# EAGLE design brobotESP12_2 (EAGLE 7.1.0)

## Sheet 1 of 2
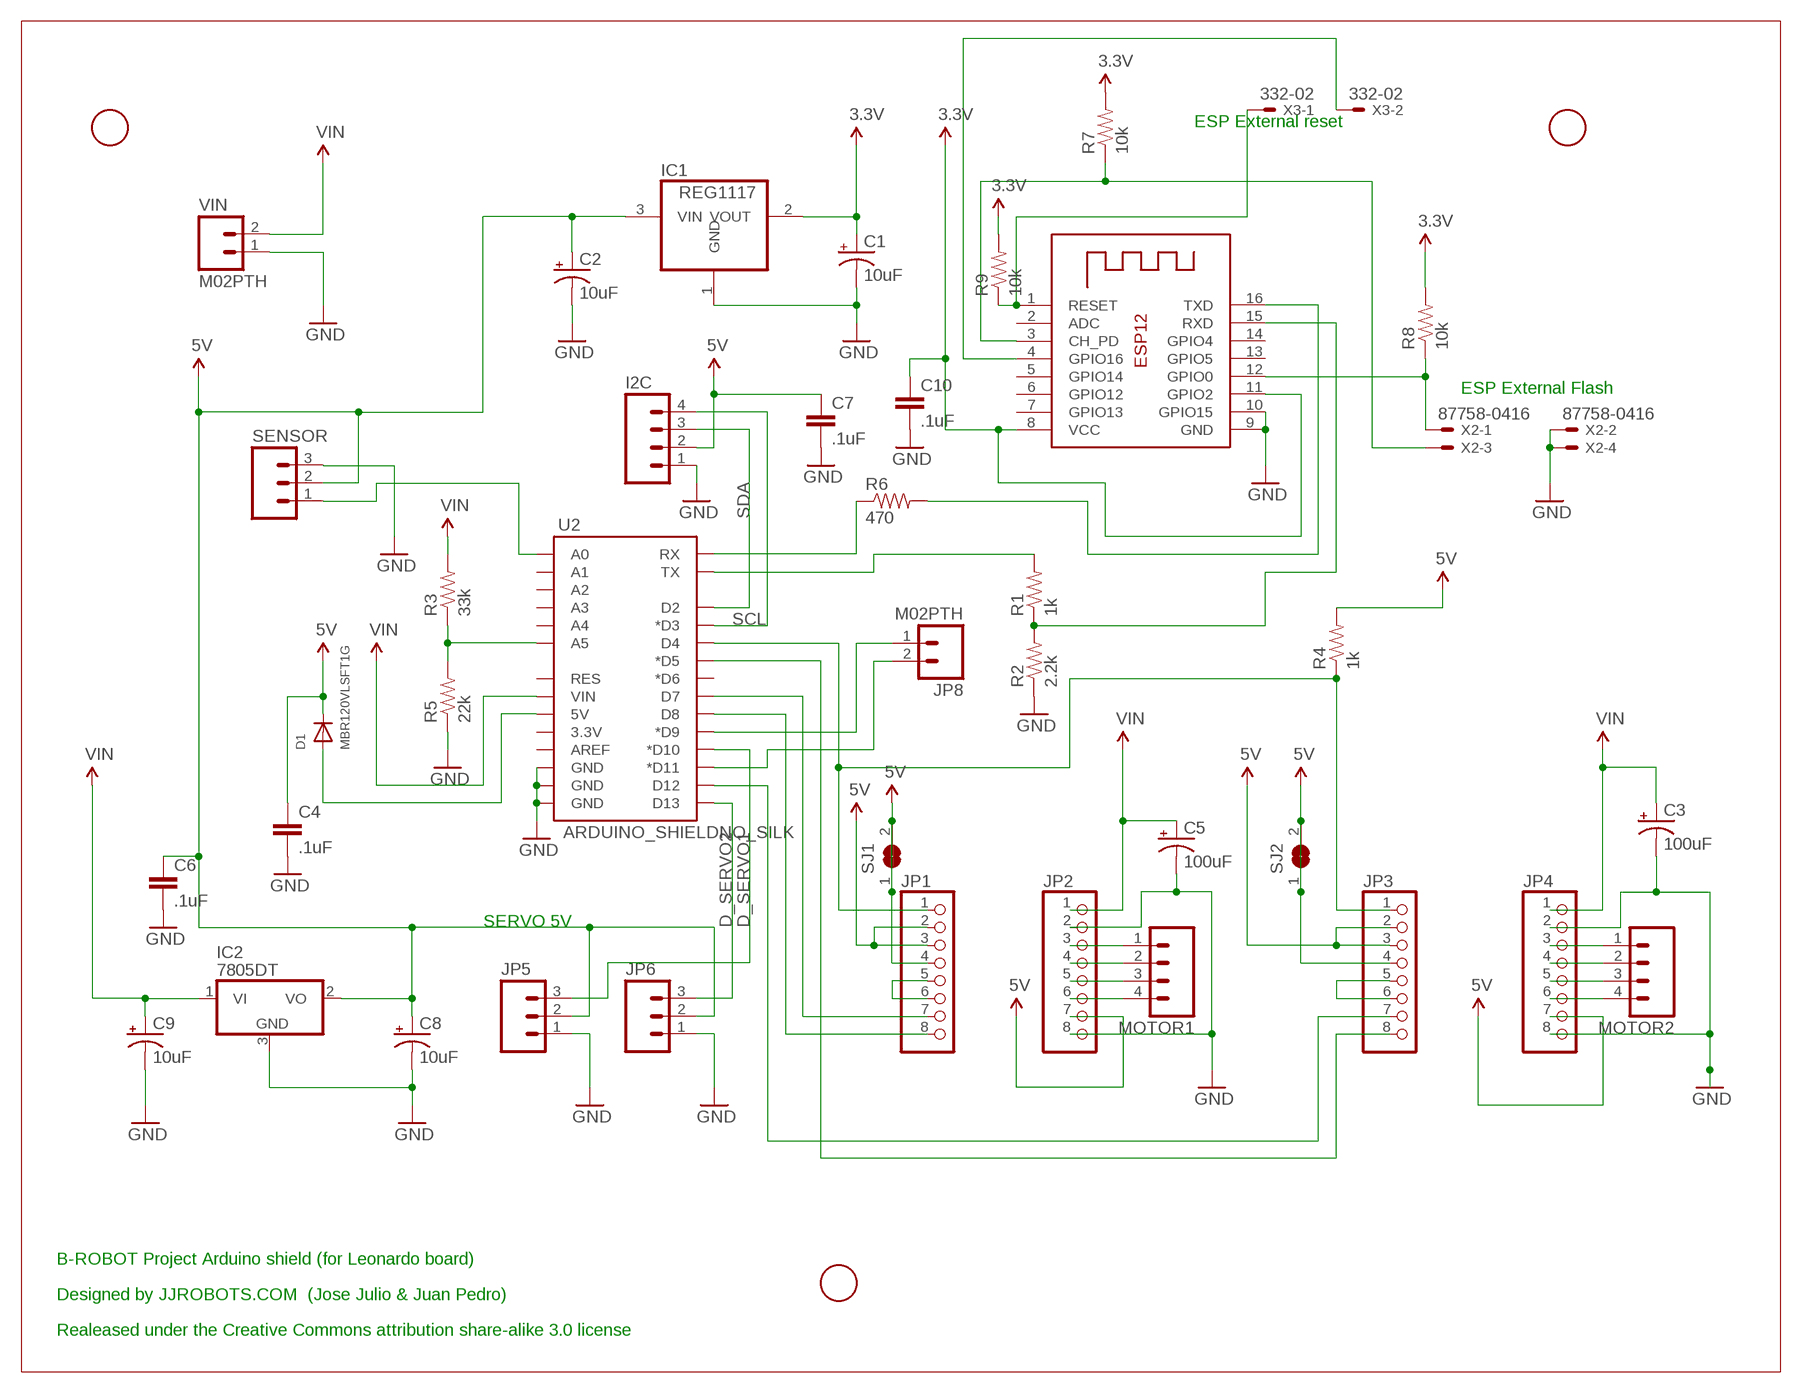
[diagram p0: schematic, sheet 1]

### Parts
C1  10uF  CAP_POL1206  [EIA3216]
C2  10uF  CAP_POL1206  [EIA3216]
C3  100uF  CAP_POLD  [PANASONIC_D]
C4  .1uF  CAP0402-CAP  [0402-CAP]
C5  100uF  CAP_POLD  [PANASONIC_D]
C6  .1uF  CAP0402-CAP  [0402-CAP]
C7  .1uF  CAP0402-CAP  [0402-CAP]
C8  10uF  CAP_POL1206  [EIA3216]
C9  10uF  CAP_POL1206  [EIA3216]
C10  .1uF  CAP0402-CAP  [0402-CAP]
D1  MBR120VLSFT1G  DIODESOD-123  [SOD-123]
I2C  M04PTH  [1X04]
IC1  REG1117  [SOT223]
IC2  7805DT  [TO252]
JP1  PINHD-1X8  [1X08]
JP2  PINHD-1X8  [1X08]
JP3  PINHD-1X8  [1X08]
JP4  PINHD-1X8  [1X08]
JP5  M03PTH  [1X03]
JP6  M03PTH  [1X03]
JP8  M02PTH  [1X02]
MOTOR1  M04PTH  [1X04]
MOTOR2  M04PTH  [1X04]
R1  1k  RESISTOR0805-RES  [0805]
R2  2.2k  RESISTOR0805-RES  [0805]
R3  33k  RESISTOR0805-RES  [0805]
R4  1k  RESISTOR0805-RES  [0805]
R5  22k  RESISTOR0805-RES  [0805]
R6  470  RESISTOR0805-RES  [0805]
R7  10k  RESISTOR0805-RES  [0805]
R8  10k  RESISTOR0805-RES  [0805]
R9  10k  RESISTOR0805-RES  [0805]
SENSOR  M03PTH  [1X03]
SJ1  SJW  [SJW]
SJ2  SJW  [SJW]
U2  ARDUINO_SHIELDNO_SILK  [DUEMILANOVE_VIAS]
U$1  FIDUCIAL  [FIDUCIAL_1MM]
U$2  FIDUCIAL  [FIDUCIAL_1MM]
U$3  FIDUCIAL  [FIDUCIAL_1MM]
VIN  M02PTH  [1X02]
X1  ESP-12  [ESP-12]
X2  87758-0416  [87758-0416]
X3  332-02  [332-02]

### Nets
3.3V [3V3]: C1.A(+) C10.1 IC1.2(VOUT) R7.2 R8.2 R9.2 X1.8(VCC) X1.11(GPIO2)
5V [5V]: C2.A(+) C4.1 C6.1 C7.1 C8.A(+) D1.C I2C.2 IC1.3(VIN) IC2.2(VO) JP1.2 JP1.3 JP1.4 JP2.7 JP3.2 JP3.3 JP3.4 JP4.7 JP5.2 JP6.2 R4.2 SENSOR.2 SJ1.1 SJ1.2 SJ2.1 SJ2.2 ; also sheet 2
A_SENSOR: SENSOR.1 U2.A0 ; also sheet 2
A_VOLTAGE [3V3]: R3.1 R5.2 U2.A5 ; also sheet 2
D4: JP1.1 JP3.1 R4.1 U2.D4 ; also sheet 2
D5: JP3.8 U2.D5(*D5) ; also sheet 2
D7: JP1.7 U2.D7 ; also sheet 2
D8: JP1.8 U2.D8 ; also sheet 2
D11: JP8.2 U2.D11(*D11) ; also sheet 2
D12: JP3.7 U2.D12 ; also sheet 2
D_SERVO1: JP5.3 U2.D10(*D10) ; also sheet 2
D_SERVO2: JP6.3 U2.D13 ; also sheet 2
GND [3V3]: C1.C(-) C2.C(-) C3.- C4.2 C5.- C6.2 C7.2 C8.C(-) C9.C(-) C10.2 I2C.1 IC1.1(GND) IC2.3(GND) JP2.2 JP2.8 JP4.2 JP4.8 JP5.1 JP6.1 R2.1 R5.1 SENSOR.3 U2.GND@0(GND) U2.GND@1(GND) U2.GND@2(GND) VIN.1 X1.9(GND) X1.10(GPIO15) X2.2 X2.4 ; also sheet 2
N$1 [VCC]: JP2.3 MOTOR1.1
N$2 [VCC]: JP2.4 MOTOR1.2
N$3: R6.2 X1.16(TXD)
N$4: R1.1 R2.2 X1.15(RXD)
N$6 [VCC]: JP2.5 MOTOR1.3
N$7 [VCC]: JP2.6 MOTOR1.4
N$8 [VCC]: JP4.3 MOTOR2.1
N$9 [VCC]: JP4.4 MOTOR2.2
N$10 [VCC]: JP4.5 MOTOR2.3
N$11: JP1.5 JP1.6
N$12: JP3.5 JP3.6
N$16 [VCC]: JP4.6 MOTOR2.4
N$18: R7.1 X1.3(CH_PD) X2.3
N$20 [3V3]: R8.1 X1.12(GPIO0) X2.1
N$26: D1.A U2.5V
N$27: JP8.1 U2.D9(*D9)
N$29: R9.1 X1.1(RESET) X3.1
N$30: X1.4(GPIO16) X3.2
RX_5V: R6.1 U2.RX ; also sheet 2
SCL [I2C]: I2C.4 U2.D3(*D3) ; also sheet 2
SDA [I2C]: I2C.3 U2.D2 ; also sheet 2
TX_5V: R1.2 U2.TX ; also sheet 2
VIN [VCC]: C3.+ C5.+ C9.A(+) IC2.1(VI) JP2.1 JP4.1 R3.2 U2.VIN VIN.2 ; also sheet 2
Unconnected: U2.3.3V U2.A1 U2.A2 U2.A3 U2.A4 U2.AREF U2.D6(*D6) U2.RES X1.2(ADC) X1.5(GPIO14) X1.6(GPIO12) X1.7(GPIO13) X1.13(GPIO5) X1.14(GPIO4)

### Notes on the sheet
- ESP External reset
- ESP External Flash
- SERVO 5V
- B-ROBOT Project Arduino shield (for Leonardo board)
- Designed by JJROBOTS.COM  (Jose Julio & Juan Pedro)
- Realeased under the Creative Commons attribution share-alike 3.0 license

## Sheet 2 of 2
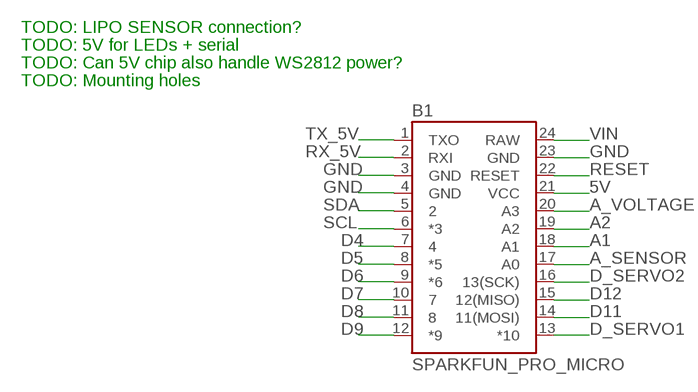
[diagram p1: schematic, sheet 2]

### Parts
B1  SPARKFUN_PRO_MICRO  [SPARKFUN_PRO_MICRO]

### Nets
5V [5V]: B1.21(VCC) ; also sheet 1
A1: B1.18(A1)
A2: B1.19(A2)
A_SENSOR: B1.17(A0) ; also sheet 1
A_VOLTAGE [3V3]: B1.20(A3) ; also sheet 1
D4: B1.7 ; also sheet 1
D5: B1.8(*5) ; also sheet 1
D6: B1.9(*6)
D7: B1.10 ; also sheet 1
D8: B1.11 ; also sheet 1
D9: B1.12(*9)
D11: B1.14(11(MOSI)) ; also sheet 1
D12: B1.15(12(MISO)) ; also sheet 1
D_SERVO1: B1.13(*10) ; also sheet 1
D_SERVO2: B1.16(13(SCK)) ; also sheet 1
GND [3V3]: B1.3(GND) B1.4(GND) B1.23(GND) ; also sheet 1
RESET: B1.22(RESET)
RX_5V: B1.2(RXI) ; also sheet 1
SCL [I2C]: B1.6(*3) ; also sheet 1
SDA [I2C]: B1.5 ; also sheet 1
TX_5V: B1.1(TXO) ; also sheet 1
VIN [VCC]: B1.24(RAW) ; also sheet 1

### Notes on the sheet
- TODO: LIPO SENSOR connection?
- TODO: 5V for LEDs + serial
- TODO: Can 5V chip also handle WS2812 power?
- TODO: Mounting holes

## Library data of the parts
B1 = SparkFun-Boards:SPARKFUN_PRO_MICRO: SparkFun Pro Micro Atmega32U4 compatible footprint. SparkFun Products: 3.3V/8MHz <https://www.sparkfun.com/products/12587> 5V/16MHz <https://www.sparkfun.com/products/12640>
C1-C3 C5 C8 C9 = SparkFun-Passives:CAP_POL: Capacitor Polarized These are standard SMD and PTH capacitors. Normally 10uF, 47uF, and 100uF in electrolytic and tantalum varieties. Always verify the external diameter of the through hole cap, it varies with capacity, voltage, and manufacturer. The EIA devices should be standard.
C4 C6 C7 C10 = SparkFun-Passives:CAP: Capacitor Standard 0603 ceramic capacitor, and 0.1" leaded capacitor.
D1 = adafruit:DIODE: Diode SMADIODE - SMA Surface Mount Package 20V 1A Schottky Diode Digikey: 641-1014-6-ND DO-1N4148 - Through Hole Small Current Diode SOD-123 20V 1 A (.5mV Vf) Schottky Diode - Digikey: MBRX120TPMSCT-ND SOD-323 10V 570mA (.38mV Vf, 3ns) Schottky Diode - Digikey: ZLLS410CT-ND SOD-523 30V 30mA Schottky Diode (RB751S-40TE61) - Digikey: RB751S-40TE61CT-ND SOT23-R/W - SOT23 Package (R = Solder Paste/Reflow Ovens, W = Hand-Soldering) BAT54Film 40V 300mA - Digikey: 497-7162-1-ND
I2C MOTOR1 MOTOR2 = SparkFun-Connectors:M04: Header 4 Standard 4-pin 0.1" header. Use with straight break away headers (SKU : PRT-00116), right angle break away headers (PRT-00553), swiss pins (PRT-00743), machine pins (PRT-00117), and female headers (PRT-00115). Molex polarized connector foot print use with SKU : PRT-08231 with associated crimp pins and housings. 1MM SMD Version SKU: PRT-10208
IC1 = burr-brown:REG1117: 800mA and 1A Low Dropout (LDO) Positive Regulator 1.8V, 2.5V, 2.85V, 3.3V, 5V, and Adj; MPN: REG1117; OC_FARNELL: 1097566; OC_NEWARK: 14P6981
IC2 = linear:78*: Positive VOLTAGE REGULATOR Source: http://cache.national.com/ds/LM/LM78L05.pdf http://www.fairchildsemi.com/ds/LM/LM7805.pdf
JP1-JP4 = pinhead:PINHD-1X8: PIN HEADER
JP5 JP6 SENSOR = SparkFun-Connectors:M03: Header 3 Standard 3-pin 0.1" header. Use with straight break away headers (SKU : PRT-00116), right angle break away headers (PRT-00553), swiss pins (PRT-00743), machine pins (PRT-00117), and female headers (PRT-00115). Molex polarized connector foot print use with SKU : PRT-08232 with associated crimp pins and housings.
JP8 VIN = SparkFun-Connectors:M02: Standard 2-pin 0.1" header. Use with - straight break away headers ( PRT-00116) - right angle break away headers (PRT-00553) - swiss pins (PRT-00743) - machine pins (PRT-00117) - female headers (PRT-00115) Molex polarized connector foot print use with: PRT-08233 with associated crimp pins and housings. 2.54_SCREWTERM for use with PRT-10571. 3.5mm Screw Terminal footprints for PRT-08084 5mm Screw Terminal footprints for use with PRT-08433
R1-R9 = SparkFun-Resistors:RESISTOR: Resistor Basic schematic elements and footprints for 0603, 1206, and PTH resistors.
SJ1 SJ2 = jumper:SJ: SMD solder JUMPER
U2 = SparkFun-Boards:ARDUINO_SHIELD: Arduino shield footprint
U$1-U$3 = adafruit:FIDUCIAL: For use by pick and place machines to calibrate the vision/machine, 1mm By microbuilder.eu
X1 = adafruit:ESP-12
X2 = con-molex:87758-0416: 4 Pin - 2mm Dual Row Single Wafer, Vertical T/H HDR Source: http://www.molex.com/pdm_docs/sd/877580616_sd.pdf; MF: FARNELL; MPN: 87758-0416; OC_FARNELL: 7472315; OC_NEWARK: 39K3681
X3 = con-garry:332-02: 2 Pin - 2mm Dual Row Source: www.mpe-connector.de / garry_shortform_2012.pdf

## Net classes
0 default: width 0.254 mm
1 VCC: width 0.813 mm
2 5V: width 0.61 mm
3 3V3: width 0.406 mm
4 I2C: width 0.305 mm

## Board
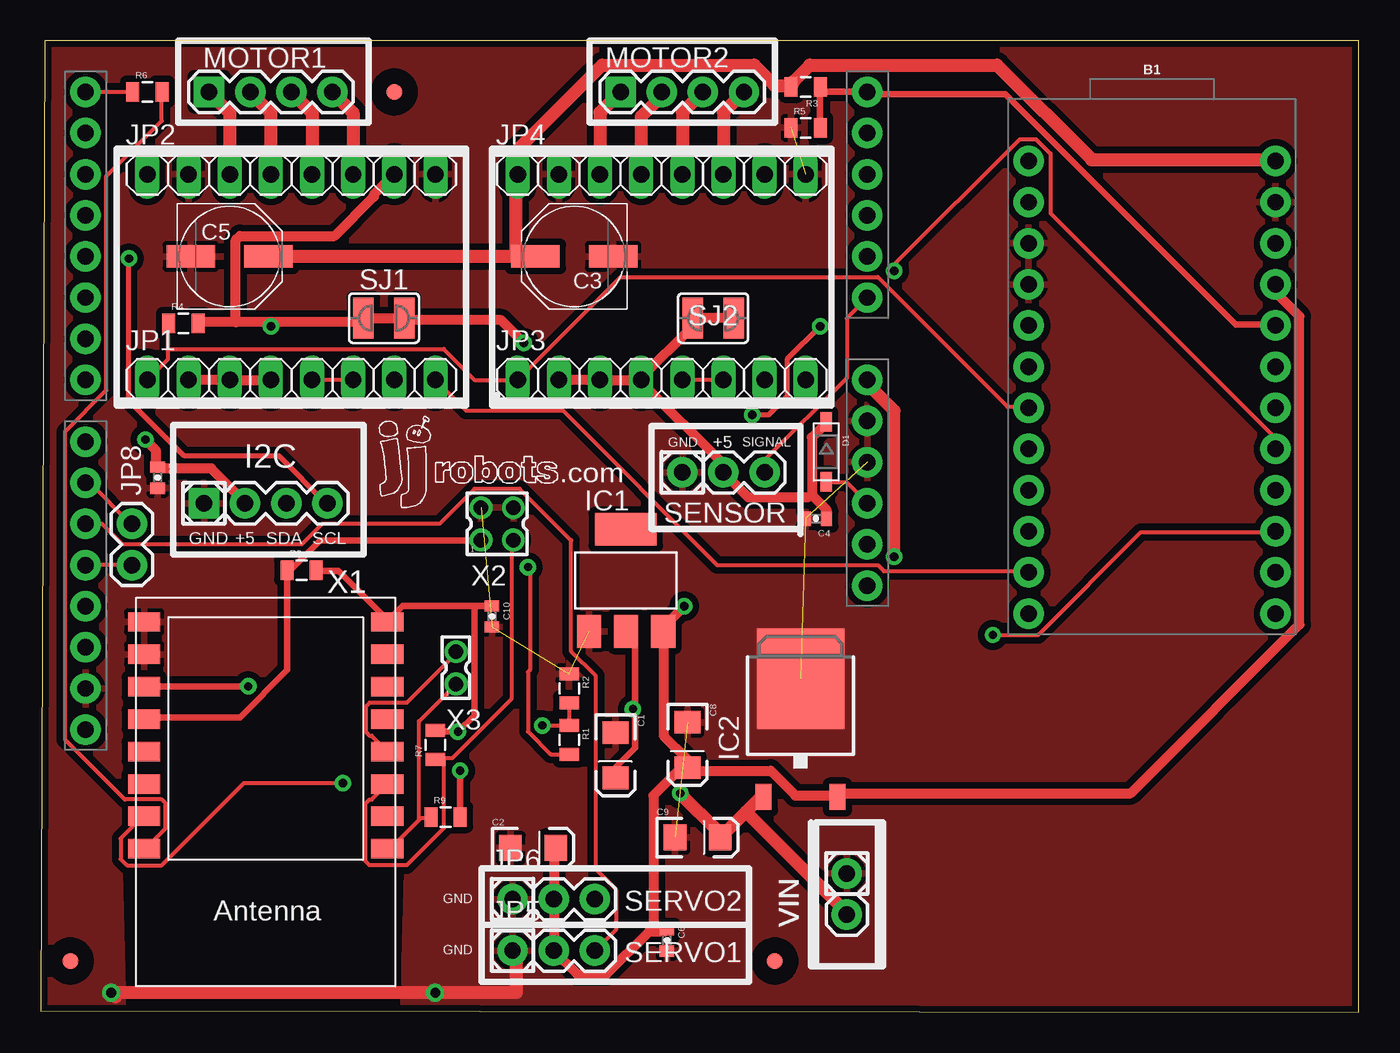
[diagram p2: board, top side]
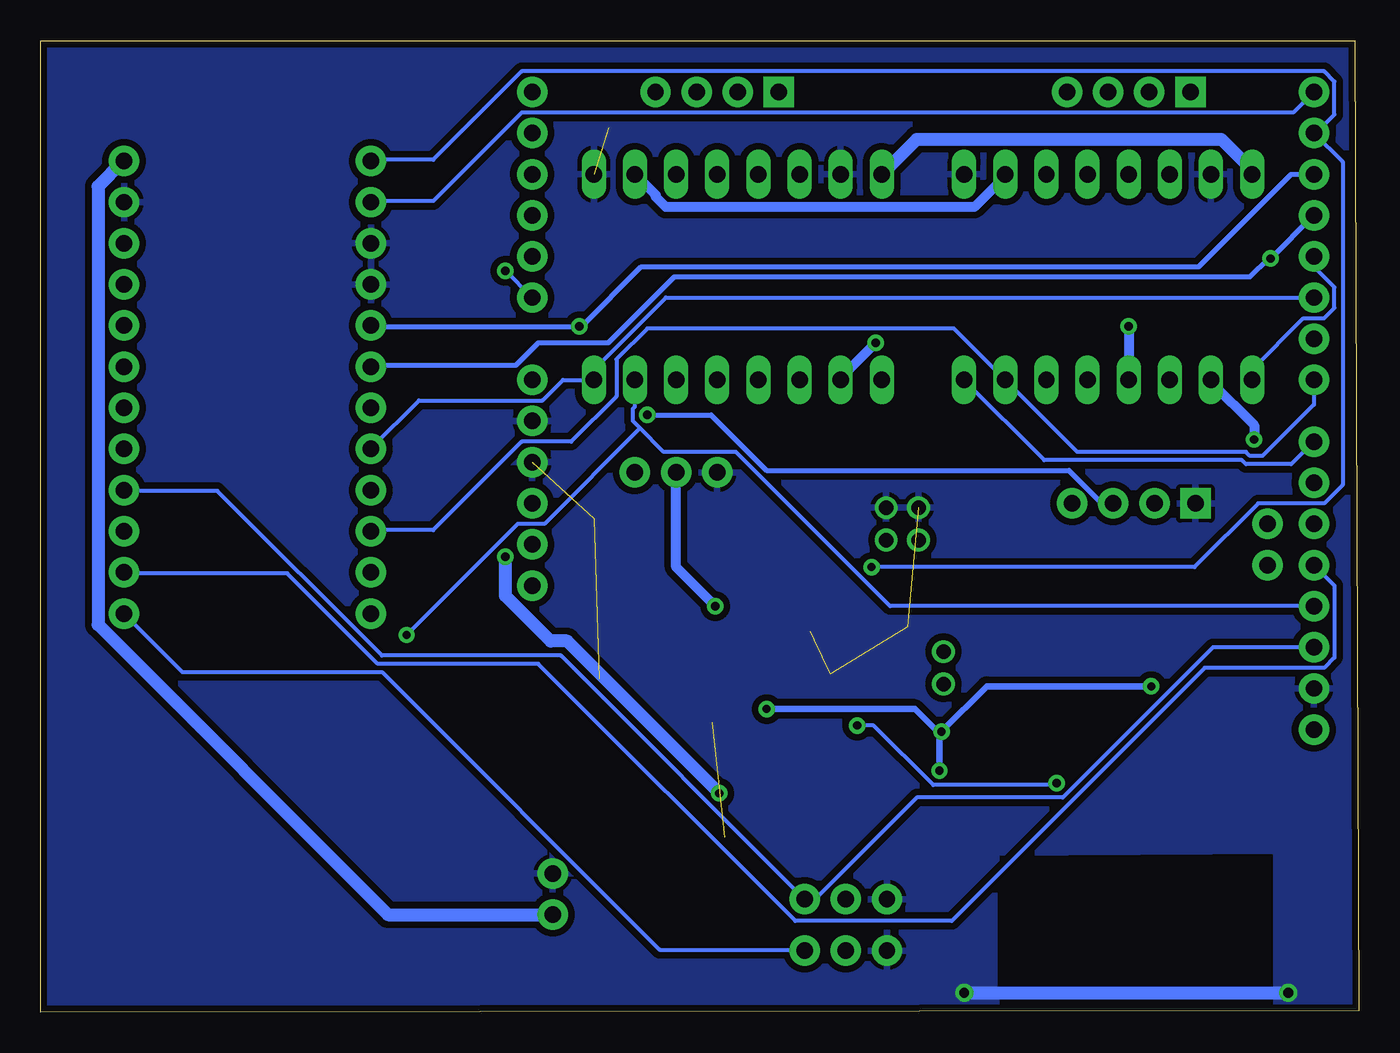
[diagram p3: board, bottom side, seen from below]

Size 81.4 x 60.01 mm. Coordinates in mm from the lower left corner, seen from the top.
Outline: 0,0.09 81.4,0 81.4,60 28.19,60.01 12.95,60.01 12.32,60 0.25,60 0,0.09
Copper layers (1*16): Top 0.035mm / dielectric 1.5mm / Bottom 0.035mm
Design rules "SparkFun-2-layer-STANDARD": minimum track width 10mil, minimum drill 20mil, track to track 10mil, track to pad 8mil, pad to pad 8mil, via to via 10mil, smd to smd 8mil, copper to edge 8mil, drill to drill 8mil, minimum pad ring 10mil, minimum via ring 10mil, stop-mask expansion 4mil, vias tented up to drill 25mil, thermal gap 10mil

### Footprints (pad centres in the part's own frame; a part is rotated, then mirrored left to right if it is on the bottom)
SPARKFUN_PRO_MICRO = drill 1.016 pad 1.88: 1 -7.62,12.7; 2 -7.62,10.16; 3 -7.62,7.62; 4 -7.62,5.08; 5 -7.62,2.54; 6 -7.62,0; 7 -7.62,-2.54; 8 -7.62,-5.08; 9 -7.62,-7.62; 10 -7.62,-10.16; 11 -7.62,-12.7; 12 -7.62,-15.24; 13 7.62,-15.24; 14 7.62,-12.7; 15 7.62,-10.16; 16 7.62,-7.62; 17 7.62,-5.08; 18 7.62,-2.54; 19 7.62,0; 20 7.62,2.54; 21 7.62,5.08; 22 7.62,7.62; 23 7.62,10.16; 24 7.62,12.7
EIA3216 = smd 1.4 x 1.6: A 1.4,0; C -1.4,0
PANASONIC_D = smd 3 x 1.4: + 2.4,0; - -2.4,0
0402-CAP = smd 0.7 x 0.9: 1 -0.65,0; 2 0.65,0
SOD-123 = smd 1.2 x 0.7: A 1.85,0; C -1.85,0
1X04 = drill 1.016 pad 1.88 square: 1 0,0 | drill 1.016 pad 1.88: 2 2.54,0; 3 5.08,0; 4 7.62,0
SOT223 = smd 1.499 x 2.007: 1 -2.261,-3.15; 2 0.025,-3.15; 3 2.311,-3.15 | smd 3.81 x 2.007: 4 0,3.15
TO252 = smd 1 x 1.6: 1 -2.28,-4.8; 2 2.28,-4.8 | smd 5.4 x 6.2: 3 0,2.5
1X08 = drill 1.016 long: 1 -8.89,0; 2 -6.35,0; 3 -3.81,0; 4 -1.27,0; 5 1.27,0; 6 3.81,0; 7 6.35,0; 8 8.89,0
1X03 = drill 1.016 pad 1.88: 1 0,0; 2 2.54,0; 3 5.08,0
1X02 = drill 1.016 pad 1.88: 1 0,0; 2 2.54,0
0805 = smd 0.8 x 1.2: 1 -0.9,0; 2 0.9,0
SJW = smd 1.27 x 2.54: 1 -1.27,0; 2 1.27,0
DUEMILANOVE_VIAS = drill 1.016 pad 1.88: 3.3V 50.8,13.97; 5V 50.8,16.51; A0 50.8,29.21; A1 50.8,31.75; A2 50.8,34.29; A3 50.8,36.83; A4 50.8,39.37; A5 50.8,41.91; AREF 2.54,2.54; D2 2.54,36.83; D3 2.54,34.29; D4 2.54,31.75; D5 2.54,29.21; D6 2.54,26.67; D7 2.54,24.13; D8 2.54,20.32; D9 2.54,17.78; D10 2.54,15.24; D11 2.54,12.7; D12 2.54,10.16; D13 2.54,7.62; GND@0 50.8,19.05; GND@1 50.8,21.59; GND@2 2.54,5.08; RES 50.8,11.43; RX 2.54,41.91; TX 2.54,39.37; VIN 50.8,24.13
FIDUCIAL_1MM = smd 1 x 1: 1 0,0
ESP-12 = smd 2 x 1.2: 1 -7.5,4.5; 2 -7.5,2.5; 3 -7.5,0.5; 4 -7.5,-1.5; 5 -7.5,-3.5; 6 -7.5,-5.5; 7 -7.5,-7.5; 8 -7.5,-9.5; 9 7.5,-9.5; 10 7.5,-7.5; 11 7.5,-5.5; 12 7.5,-3.5; 13 7.5,-1.5; 14 7.5,0.5; 15 7.5,2.5; 16 7.5,4.5
87758-0416 = drill 0.9 pad 1.27: 1 -1,-1; 2 -1,1; 3 1,-1; 4 1,1
332-02 = drill 0.9 pad 1.27: 1 0,-1; 2 0,1

### Placement (x,y rotation side)
B1  68.62,39.87 0 top
C1  35.49,15.88 270 top
C2  30.41,10.16 0 top
C3  32.95,46.67 180 top
C4  47.88,30.48 180 top
C5  11.68,46.67 0 top
C6  38.67,4.45 270 top
C7  7.23,33.02 270 top
C8  39.94,16.51 270 top
C9  40.57,10.8 0 top
C10  27.87,24.45 270 top
D1  48.51,34.61 270 top
I2C  10.09,31.43 0 top
IC1  36.13,26.67 0 top
IC2  46.92,18.1 0 top
JP1  15.49,39.05 0 top
JP2  15.49,51.75 0 top
JP3  38.35,39.05 0 top
JP4  38.35,51.75 0 top
JP5  29.14,3.81 0 top
JP6  29.14,6.99 0 top
JP8  5.65,30.16 270 top
MOTOR1  10.41,56.83 0 top
MOTOR2  35.81,56.83 0 top
R1  32.64,16.83 270 top
R2  32.64,20 270 top
R3  47.24,57.15 180 top
R4  8.82,42.55 0 top
R5  47.24,54.61 0 top
R6  6.6,56.83 0 top
R7  24.38,16.51 90 top
R8  16.13,27.31 0 top
R9  25.02,12.07 0 top
SENSOR  44.7,33.34 180 top
SJ1  21.21,42.86 0 top
SJ2  41.53,42.86 0 top
U2  0.25,14.92 0 top
U$1  1.84,3.18 0 top
U$2  21.84,56.83 0 top
U$3  45.34,3.18 0 top
VIN  49.78,8.57 270 top
X1  13.9,14.61 180 top
X2  28.19,30.16 0 top
X3  25.65,21.27 0 top

### Tracks (layer width: path | path; a pad name or v marks a point on that pad's centre or on a via)
3.3V  (via drill 0.51)
  Top 0.406: 26.79,25.08 22.35,25.08 21.46,24.19 X1.8 21.33,24.32 18.41,27.24 17.14,27.24 R8.2 | 26.79,25.08 27.81,25.08 C10.1 | 36.7,18.73 36.7,22.92 36.19,23.43 IC1.2 | 36.7,18.73 36.7,16.32 35.56,15.18 35.56,14.54 C1.A | v25.9,14.92 25.9,12.13 R9.2 | R7.2 24.38,17.34 v25.78,17.34 26.79,18.35 26.79,25.08 | v12.82,20.13 6.47,20.13 X1.11 | v36.57,18.73 36.7,18.73
  Bottom 0.406: v25.9,14.92 25.9,17.21 v25.78,17.34 | v12.82,20.13 22.98,20.13 v25.78,17.34 | v36.57,18.73 27.43,18.73 26.03,17.34 v25.78,17.34
5V  (via drill 0.51)
  Top 0.61: I2C.2 12.7,31.43 10.54,33.59 7.23,33.59 C7.1 7.11,33.97 7.11,34.74 v6.47,35.37 | JP1.2 JP1.3 JP1.4 | 14.22,42.61 19.68,42.61 SJ1.1 SJ1.2 22.73,42.74 28.44,42.74 v29.84,41.34 | 14.22,42.61 12.06,42.61 | 12.06,42.61 9.78,42.61 R4.2 | JP2.7 20.57,50.48 20.57,50.36 18.16,47.94 12.32,47.94 12.06,47.69 12.06,42.61 | v14.22,42.36 14.22,42.61 | 47.62,31.94 48.51,31.05 48.51,30.54 C4.1 | 47.62,31.94 47.62,35.5 48.51,36.39 D1.C | 47.62,31.94 47.37,31.81 43.68,31.81 SENSOR.2 42.03,33.59 42.03,33.97 37.21,38.8 JP3.4 | SJ2.2 SJ2.1 40.13,42.61 40.13,42.23 37.21,39.31 JP3.4 | JP3.2 JP3.3 JP3.4 | C2.A 31.75,10.1 31.75,7.05 JP6.2 31.75,6.8 31.75,4 JP5.2 33.14,2.35 34.92,2.35 37.59,5.02 37.84,5.02 | 37.84,5.02 38.6,5.02 C6.1 | C8.A 39.87,15.18 39.87,15.69 38.48,17.08 38.48,23.43 IC1.3 38.48,23.81 v39.75,25.08 | C8.A 40.13,14.92 45.08,14.92 46.61,13.4 49.15,13.4 IC2.2 49.4,13.53 67.31,13.53 77.72,23.94 77.72,42.99 76.32,44.39 76.32,44.9 B1.21 | 37.84,5.02 37.84,13.4 39.62,15.18 C8.A
  Bottom 0.61: JP4.7 43.43,50.48 43.43,50.36 42.8,49.72 23.75,49.72 21.84,51.63 JP2.7 | v14.22,42.36 JP1.4 | v6.47,35.37 6.47,36.26 9.14,38.93 JP1.2 | SENSOR.2 42.16,27.5 v39.75,25.08 | v29.84,41.34 32,39.18 JP3.2
A_SENSOR  (via drill 0.51)
  Top 0.254: SENSOR.1 44.7,34.1 49.78,39.18 49.78,42.86 U2.A0 | v52.7,45.78 52.7,46.17 60.45,53.91 61.46,53.91 62.35,53.02 62.35,49.34 76.2,35.5 76.2,34.86 B1.17
  Bottom 0.254: U2.A0 v52.7,45.78
A_VOLTAGE
  Top 0.406: R5.2 48.13,54.67 48.13,57.09 R3.1 48.26,56.83 U2.A5 51.18,56.71 59.56,56.71 73.78,42.48 76.2,42.48 B1.20
D4
  Top 0.254: 7.87,40.96 7.87,40.32 JP1.1 | 7.87,40.96 7.87,42.48 R4.1 | 7.87,40.96 24.89,40.96 26.79,39.05 JP3.1 35.81,45.4 51.69,45.4 59.69,37.4 60.96,37.4 B1.7
  Bottom 0.254: U2.D4 2.79,46.04 1.52,44.77 1.52,43.5 2.16,42.86 3.43,42.86 6.6,39.69 JP1.1
D5
  Bottom 0.254: B1.8 60.96,34.86 58.04,37.78 50.42,37.78 49.15,39.05 JP3.8 47.24,39.69 42.8,44.13 U2.D5
D7
  Bottom 0.254: U2.D7 2.79,37.53 5.96,34.35 6.73,34.35 6.98,34.61 17.39,34.61 JP1.7 25.02,42.23 43.94,42.23 45.84,40.32 45.84,38.04 48.64,35.24 51.69,35.24 57.15,29.78 60.96,29.78 B1.10
D8
  Top 0.254: JP1.8 26.29,37.15 32.25,37.15 41.78,27.62 51.69,27.62 52.07,27.24 60.96,27.24 B1.11
  Bottom 0.254: JP1.8 19.43,34.1 7.23,34.1 6.98,33.85 4.19,33.85 U2.D8
D11
  Top 0.254: JP8.2 U2.D11
  Bottom 0.254: U2.D11 1.52,26.35 1.52,21.91 2.16,21.27 9.52,21.27 25.14,5.65 34.79,5.65 50.67,21.53 60.58,21.53 66.16,27.12 76.2,27.12 B1.14
D12  (via drill 0.51)
  Top 0.254: v58.8,23.31 61.59,23.31 67.94,29.66 76.2,29.66 B1.15
  Bottom 0.254: JP3.7 44.7,37.4 44.83,37.28 44.83,36.51 44.38,36.07 | 44.38,36.07 42.92,34.61 38.48,34.61 28.95,25.08 U2.D12 | v58.8,23.31 51.94,30.16 50.29,30.16 44.38,36.07
D_SERVO1
  Top 0.254: U2.D10 3.81,30.16 5.08,28.89 16.13,28.89 17.39,30.16 24.63,30.16 26.79,32.32 29.59,32.32 32.76,29.15 32.76,22.29 34.29,20.77 34.29,8.83 35.56,7.56 35.56,5.14 JP5.3
  Bottom 0.254: JP5.3 34.29,3.87 43.18,3.87 60.32,21.02 72.64,21.02 76.2,24.58 B1.13
D_SERVO2
  Bottom 0.254: U2.D13 9.01,22.54 18.28,13.27 27.3,13.27 33.52,7.05 34.16,7.05 JP6.3 49.27,22.04 60.32,22.04 70.48,32.2 76.2,32.2 B1.16
GND  (via drill 0.6)  (7 unrouted)
  Top 0.813: JP5.1 29.37,3.81 29.37,1.21 4.62,1.21 4.62,0.96
  Bottom 0.813: v24.37,1.21 4.62,1.21
  other vias: 4.37,1.21
  pour Top (isolate 0.406): 0.25,60.01 81.73,60.01 81.73,0.36 22.4,-0.23 22.65,9.84 4.87,9.96 5.12,0.09 0.25,0.09
  pour Bottom (isolate 0.406): 0.25,60.01 81.73,60.01 81.73,0.36 22.4,-0.23 22.4,9.84 4.62,9.96 4.62,9.84 5.12,9.84 5.12,-0.04 0.12,-0.04 0.12,0.21 0.25,9.84
  pour Top (no thermals): 44.06,24.13 50.1,24.13 50.1,16.83 44.06,16.83
N$1
  Top 0.813: JP2.3 11.68,55.56 MOTOR1.1
N$2
  Top 0.813: JP2.4 14.22,55.56 MOTOR1.2
N$3
  Top 0.254: R6.2 7.49,55.06 4.06,51.63 4.06,38.42 1.52,35.88 1.52,16.83 5.2,13.15 7.49,13.15 7.74,12.89 7.74,11.37 6.47,10.1 X1.16
N$4  (via drill 0.51)
  Top 0.254: R2.2 R1.1 32.64,17.72 v30.98,17.72 | v18.67,14.16 12.57,14.16 7.49,9.08 5.33,9.08 4.95,9.46 4.95,10.73 6.35,12.13 X1.15
  Bottom 0.254: v30.98,17.72 29.97,17.72 26.29,14.03 18.79,14.03 v18.67,14.16
N$6
  Top 0.813: JP2.5 16.76,55.56 MOTOR1.3
N$7
  Top 0.813: JP2.6 19.3,55.56 MOTOR1.4
N$8
  Top 0.813: JP4.3 34.54,55.56 MOTOR2.1
N$9
  Top 0.813: JP4.4 37.08,55.31 38.35,56.58 MOTOR2.2
N$10
  Top 0.813: JP4.5 39.62,55.56 MOTOR2.3
N$11
  Top 0.254: JP1.6 JP1.5
N$12
  Top 0.254: JP3.6 JP3.5
N$16
  Top 0.813: JP4.6 42.16,55.56 MOTOR2.4
N$18
  Top 0.254: 24.89,15.69 25.4,15.69 29.08,19.37 29.08,29.15 X2.3 | 24.89,15.69 24.38,15.69 R7.1 24.89,15.69 | 24.89,15.69 24.89,11.37 22.6,9.08 20.32,9.08 20.06,9.34 20.06,12.89 20.32,13.15 20.44,13.15 21.33,14.03 X1.3
N$20
  Top 0.406: X2.1 27.17,29.15 17.27,29.15 15.49,27.37 15.24,27.37 R8.1 15.24,27.12 15.24,21.15 12.32,18.23 6.47,18.23 X1.12
N$26
  Top 0.254: U2.5V 49.78,32.7 48.51,32.7 D1.A
N$27
  Top 0.254: U2.D9 3.04,32.7 5.58,30.16 JP8.1
N$29
  Top 0.254: 23.43,11.94 21.71,10.22 21.46,10.22 X1.1 | 23.43,11.94 23.49,12 24,12 R9.1 | X3.1 25.65,20.26 23.36,17.97 23.36,12 23.43,11.94
N$30
  Top 0.254: X1.4 21.33,16.19 20.44,17.08 20.32,17.08 20.06,17.34 20.06,18.86 20.32,19.11 22.6,19.11 25.65,22.16 X3.2
RX_5V
  Top 0.254: U2.RX R6.1
  Bottom 0.254: U2.RX 4.06,55.56 51.69,55.56 57.15,50.1 60.96,50.1 B1.2
SCL  (via drill 0.51)
  Top 0.305: v5.46,46.55 5.46,37.78 8.89,34.35 14.73,34.35 17.65,31.43 I2C.4
  Bottom 0.305: U2.D3 v5.46,46.55 5.58,46.55 6.73,45.4 42.29,45.4 46.35,41.34 50.67,41.34 52.07,39.94 60.96,39.94 B1.6
SDA  (via drill 0.51)
  Top 0.305: v43.94,36.89 44.95,36.89 46.1,38.04 46.1,40.32 v48.13,42.36
  Bottom 0.305: I2C.3 15.87,31.43 17.9,33.47 36.57,33.47 40,36.89 v43.94,36.89 | B1.5 60.96,42.36 v48.13,42.36 48,42.36 44.32,46.04 9.9,46.04 4.19,51.75 U2.D2
TX_5V  (via drill 0.51)
  Top 0.254: v30.1,27.5 30.22,27.37 30.22,21.15 30.1,21.02 30.1,17.34 31.49,15.94 32.64,15.94 R1.2
  Bottom 0.254: v30.1,27.5 10.16,27.5 6.22,31.43 2.16,31.43 1.01,32.58 1.01,52.52 U2.TX 2.66,54.29 1.52,55.44 1.52,57.47 2.16,58.1 51.69,58.1 57.15,52.64 60.96,52.64 B1.1
VIN  (via drill 0.51)
  Top 0.813: 43.56,12.38 44.57,13.4 IC2.1 | 43.56,12.38 42.03,10.86 C9.A 41.91,11.11 v39.49,13.53 | 43.56,12.38 49.78,6.16 VIN.2 | U2.VIN 51.05,38.8 52.7,37.15 v52.7,28.13 | C5.+ C3.+ 29.33,47.05 29.33,51.37 JP4.1 29.46,53.28 34.67,58.48 44.06,58.48 45.34,57.21 46.22,57.21 R3.2 46.48,57.47 47.49,58.48 59.05,58.48 64.89,52.64 76.2,52.64 B1.24
  Bottom 0.813: v52.7,28.13 52.7,25.72 49.91,22.92 48.89,22.92 v39.49,13.53 | JP2.1 6.6,52.01 8.5,53.91 27.3,53.91 JP4.1 | VIN.2 59.94,6.03 77.85,23.94 77.85,50.99 76.32,52.52 B1.24

### Text on the board
tNames: GND | +5 | SIGNAL | .com | GND | +5 | SDA | SCL | VIN | GND | SERVO2 | GND | SERVO1
tSilk: BRobot | BRobot
_tsilk: BRobot v1.0
_bsilk: JJROBOTS.com | BRobot v1.0
_tNames: MOTOR1 | MOTOR2 | SJ1 | SJ2 | C5 | C3 | I2C | SENSOR | JMP | C4 | - | +
201bmp: G:/Users/Juan Pedro/Desktop/jJrobots/logotipo JJROBOTS negro minusculo 7 mm.bmp